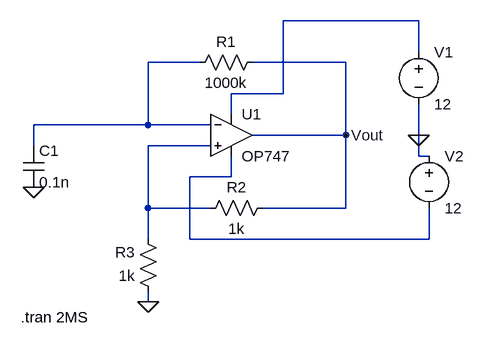
[diagram p0: schematic ATABLE_MULTIVIBRATOR.asc]
ATABLE_MULTIVIBRATOR.asc, the LTspice schematic file:
Version 4
SHEET 1 880 680
WIRE 464 -48 256 -48
WIRE 464 0 464 -48
WIRE 128 16 48 16
WIRE 352 16 208 16
WIRE 256 64 256 -48
WIRE 256 64 176 64
WIRE 176 96 176 64
WIRE 48 112 48 16
WIRE 48 112 -128 112
WIRE 144 112 48 112
WIRE 352 128 352 16
WIRE 352 128 208 128
WIRE 464 128 464 80
WIRE -128 144 -128 112
WIRE 144 144 48 144
WIRE 464 160 464 128
WIRE 480 160 464 160
WIRE 176 192 176 160
WIRE 176 192 112 192
WIRE 48 240 48 144
WIRE 144 240 48 240
WIRE 352 240 352 128
WIRE 352 240 224 240
WIRE 48 288 48 240
WIRE 112 288 112 192
WIRE 480 288 480 240
WIRE 480 288 112 288
WIRE 48 384 48 368
FLAG 352 128 Vout
FLAG 48 384 0
FLAG -128 208 0
FLAG 464 128 0
SYMBOL OpAmps\\OP747 176 64 R0
SYMATTR InstName U1
SYMBOL res 224 0 R90
WINDOW 0 0 56 VBottom 2
WINDOW 3 32 56 VTop 2
SYMATTR InstName R1
SYMATTR Value 1000k
SYMBOL res 240 224 R90
WINDOW 0 0 56 VBottom 2
WINDOW 3 32 56 VTop 2
SYMATTR InstName R2
SYMATTR Value 1k
SYMBOL res 64 384 R180
WINDOW 0 36 76 Left 2
WINDOW 3 36 40 Left 2
SYMATTR InstName R3
SYMATTR Value 1k
SYMBOL cap -144 144 R0
SYMATTR InstName C1
SYMATTR Value 0.1n
SYMBOL voltage 464 -16 R0
WINDOW 123 0 0 Left 0
WINDOW 39 0 0 Left 0
SYMATTR InstName V1
SYMATTR Value 12
SYMBOL voltage 480 144 R0
WINDOW 123 0 0 Left 0
WINDOW 39 0 0 Left 0
SYMATTR InstName V2
SYMATTR Value 12
TEXT -148 408 Left 2 !.tran 2MS

The netlist it stands for:
* ATABLE_MULTIVIBRATOR.asc
XU1 N003 N002 N001 N004 Vout OP747  ; pins In+ In- V+ V- OUT
R1 Vout N002 1000k
R2 Vout N003 1k
R3 0 N003 1k
C1 N002 0 0.1n
V1 N001 0 12
V2 0 N004 12
.tran 2MS
.backanno
.end